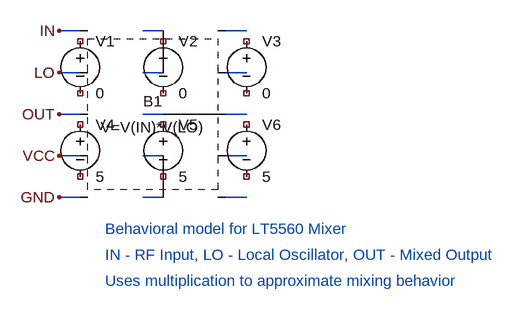
[diagram p0: schematic mixerchat.asc]
mixerchat.asc, the LTspice schematic file:
Version 4
SHEET 1 880 680
WIRE 128 96 96 96
WIRE 256 96 224 96
WIRE 384 96 352 96
WIRE 128 160 96 160
WIRE 256 160 224 160
WIRE 384 160 352 160
WIRE 128 224 96 224
WIRE 256 224 224 224
WIRE 384 224 352 224
WIRE 128 288 96 288
WIRE 256 288 224 288
WIRE 384 288 352 288
WIRE 128 352 96 352
WIRE 256 352 224 352
WIRE 384 352 352 352
FLAG 96 96 IN
FLAG 96 160 LO
FLAG 96 224 OUT
FLAG 96 288 VCC
FLAG 96 352 GND
SYMBOL voltage 128 96 R0
SYMATTR InstName V1
SYMATTR Value 0
SYMBOL voltage 256 96 R0
SYMATTR InstName V2
SYMATTR Value 0
SYMBOL voltage 384 96 R0
SYMATTR InstName V3
SYMATTR Value 0
SYMBOL voltage 128 224 R0
SYMATTR InstName V4
SYMATTR Value 5
SYMBOL voltage 256 224 R0
SYMATTR InstName V5
SYMATTR Value 5
SYMBOL voltage 384 224 R0
SYMATTR InstName V6
SYMATTR Value 5
SYMBOL behavioral 256 352 R0
SYMATTR InstName B1
SYMATTR Value V=V(IN)*V(LO)
TEXT 160 400 Left 2 ; Behavioral model for LT5560 Mixer
TEXT 160 440 Left 2 ; IN - RF Input, LO - Local Oscillator, OUT - Mixed Output
TEXT 160 480 Left 2 ; Uses multiplication to approximate mixing behavior

The netlist it stands for:
* mixerchat.asc
V1 NC_01 NC_02 0
V2 NC_03 NC_04 0
V3 NC_05 NC_06 0
V4 NC_07 NC_08 5
V5 NC_09 NC_10 5
V6 NC_11 NC_12 5
* B1: V=V(IN)*V(LO) (symbol behavioral not available, pin order unknown); nets seen at it: GND, IN, LO, N001, N002, N003, N004, N005, N006, N007, N008, N009, N010, OUT, VCC
*  Behavioral model for LT5560 Mixer
*  IN - RF Input, LO - Local Oscillator, OUT - Mixed Output
*  Uses multiplication to approximate mixing behavior
.backanno
.end